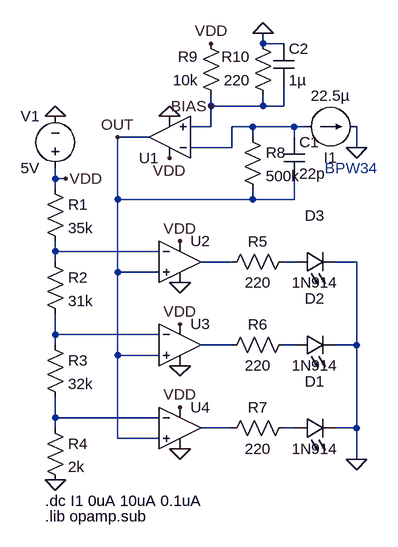
[diagram p0: schematic analog-scheme.asc]
analog-scheme.asc, the LTspice schematic file:
Version 4.1
SHEET 1 1024 848
WIRE 496 -96 496 -112
WIRE 528 -96 496 -96
WIRE 416 0 416 -16
WIRE 496 0 496 -16
WIRE 496 0 416 0
WIRE 528 0 528 -32
WIRE 528 0 496 0
WIRE 416 32 416 0
WIRE 416 32 384 32
WIRE 480 32 448 32
WIRE 544 32 480 32
WIRE 560 32 544 32
WIRE 320 48 272 48
WIRE 480 48 480 32
WIRE 544 48 544 32
WIRE 448 64 448 32
WIRE 448 64 384 64
WIRE 640 64 640 32
WIRE 176 112 176 96
WIRE 192 112 176 112
WIRE 176 128 176 112
WIRE 272 144 272 48
WIRE 480 144 480 128
WIRE 480 144 272 144
WIRE 544 144 544 112
WIRE 544 144 480 144
WIRE 176 224 176 208
WIRE 336 224 176 224
WIRE 176 240 176 224
WIRE 448 240 400 240
WIRE 544 240 528 240
WIRE 640 240 608 240
WIRE 272 256 272 144
WIRE 336 256 272 256
WIRE 176 352 176 320
WIRE 336 352 176 352
WIRE 176 368 176 352
WIRE 448 368 400 368
WIRE 544 368 528 368
WIRE 640 368 640 240
WIRE 640 368 608 368
WIRE 272 384 272 256
WIRE 336 384 272 384
WIRE 176 480 176 448
WIRE 336 480 176 480
WIRE 176 496 176 480
WIRE 448 496 400 496
WIRE 544 496 528 496
WIRE 640 496 640 368
WIRE 640 496 608 496
WIRE 272 512 272 384
WIRE 336 512 272 512
WIRE 640 544 640 496
FLAG 352 16 0
FLAG 176 16 0
FLAG 640 64 0
FLAG 176 576 0
FLAG 640 544 0
FLAG 368 272 0
FLAG 192 112 VDD
FLAG 368 400 0
FLAG 368 528 0
FLAG 352 80 VDD
FLAG 368 208 VDD
FLAG 368 336 VDD
FLAG 368 464 VDD
FLAG 416 -96 VDD
FLAG 496 -112 0
FLAG 272 48 OUT
FLAG 416 0 BIAS
SYMBOL res 464 32 R0
SYMATTR InstName R8
SYMATTR Value 500k
SYMBOL cap 528 48 R0
SYMATTR InstName C1
SYMATTR Value 22p
SYMBOL voltage 176 112 R180
WINDOW 0 24 96 Left 2
WINDOW 3 24 16 Left 2
SYMATTR InstName V1
SYMATTR Value 5V
SYMBOL current 560 32 R270
WINDOW 0 -32 40 VBottom 2
WINDOW 3 32 40 VTop 2
WINDOW 123 0 0 Left 0
WINDOW 39 0 0 Left 0
SYMATTR InstName I1
SYMATTR Value 22.5µ
SYMBOL res 160 112 R0
SYMATTR InstName R1
SYMATTR Value 35k
SYMBOL res 160 224 R0
SYMATTR InstName R2
SYMATTR Value 31k
SYMBOL res 160 352 R0
SYMATTR InstName R3
SYMATTR Value 32k
SYMBOL res 160 480 R0
SYMATTR InstName R4
SYMATTR Value 2k
SYMBOL res 432 256 R270
WINDOW 0 32 56 VTop 2
WINDOW 3 0 56 VBottom 2
SYMATTR InstName R5
SYMATTR Value 220
SYMBOL res 432 384 R270
WINDOW 0 32 56 VTop 2
WINDOW 3 0 56 VBottom 2
SYMATTR InstName R6
SYMATTR Value 220
SYMBOL res 432 512 R270
WINDOW 0 32 56 VTop 2
WINDOW 3 0 56 VBottom 2
SYMATTR InstName R7
SYMATTR Value 220
SYMBOL LED 544 512 R270
WINDOW 0 72 32 VTop 2
WINDOW 3 0 32 VBottom 2
SYMATTR InstName D1
SYMATTR Value 1N914
SYMBOL LED 544 384 R270
WINDOW 0 72 32 VTop 2
WINDOW 3 0 32 VBottom 2
SYMATTR InstName D2
SYMATTR Value 1N914
SYMBOL LED 544 256 R270
WINDOW 0 72 32 VTop 2
WINDOW 3 0 32 VBottom 2
SYMATTR InstName D3
SYMATTR Value 1N914
SYMBOL OpAmps\\UniversalOpAmp2 352 48 R180
SYMATTR InstName U1
SYMBOL OpAmps\\UniversalOpAmp2 368 240 R0
SYMATTR InstName U2
SYMBOL OpAmps\\UniversalOpAmp2 368 368 R0
SYMATTR InstName U3
SYMBOL OpAmps\\UniversalOpAmp2 368 496 R0
SYMATTR InstName U4
SYMBOL res 432 0 R180
WINDOW 0 36 76 Left 2
WINDOW 3 36 40 Left 2
SYMATTR InstName R9
SYMATTR Value 10k
SYMBOL res 512 0 R180
WINDOW 0 36 76 Left 2
WINDOW 3 36 40 Left 2
SYMATTR InstName R10
SYMATTR Value 220
SYMBOL cap 512 -96 R0
SYMATTR InstName C2
SYMATTR Value 1µ
TEXT 160 608 Left 2 !.dc I1 0uA 10uA 0.1uA
TEXT 160 632 Left 2 !.lib opamp.sub
TEXT 632 96 Center 2 ;BPW34

The netlist it stands for:
* analog-scheme.asc
R8 N001 OUT 500k
C1 N001 OUT 22p
V1 VDD 0 5V
I1 N001 0 22.5µ
R1 VDD N002 35k
R2 N002 N005 31k
R3 N005 N008 32k
R4 N008 0 2k
R5 N003 N004 220
R6 N006 N007 220
R7 N009 N010 220
D1 N010 0 1N914
D2 N007 0 1N914
D3 N004 0 1N914
X§U1 BIAS N001 VDD 0 OUT level2 Avol=1Meg GBW=10Meg Slew=10Meg Ilimit=25m Rail=0 Vos=0 En=0 Enk=0 In=0 Ink=0 Rin=500Meg  ; pins In+ In- V+ V- OUT
X§U2 OUT N002 VDD 0 N003 level2 Avol=1Meg GBW=10Meg Slew=10Meg Ilimit=25m Rail=0 Vos=0 En=0 Enk=0 In=0 Ink=0 Rin=500Meg  ; pins In+ In- V+ V- OUT
X§U3 OUT N005 VDD 0 N006 level2 Avol=1Meg GBW=10Meg Slew=10Meg Ilimit=25m Rail=0 Vos=0 En=0 Enk=0 In=0 Ink=0 Rin=500Meg  ; pins In+ In- V+ V- OUT
X§U4 OUT N008 VDD 0 N009 level2 Avol=1Meg GBW=10Meg Slew=10Meg Ilimit=25m Rail=0 Vos=0 En=0 Enk=0 In=0 Ink=0 Rin=500Meg  ; pins In+ In- V+ V- OUT
R9 BIAS VDD 10k
R10 BIAS 0 220
C2 0 BIAS 1µ
.model D D
.lib standard.dio
.dc I1 0uA 10uA 0.1uA
.lib opamp.sub
* BPW34
.lib UniversalOpAmp2.lib
.backanno
.end